# EAGLE design sound_localizer_v1 (EAGLE 7.6.0)
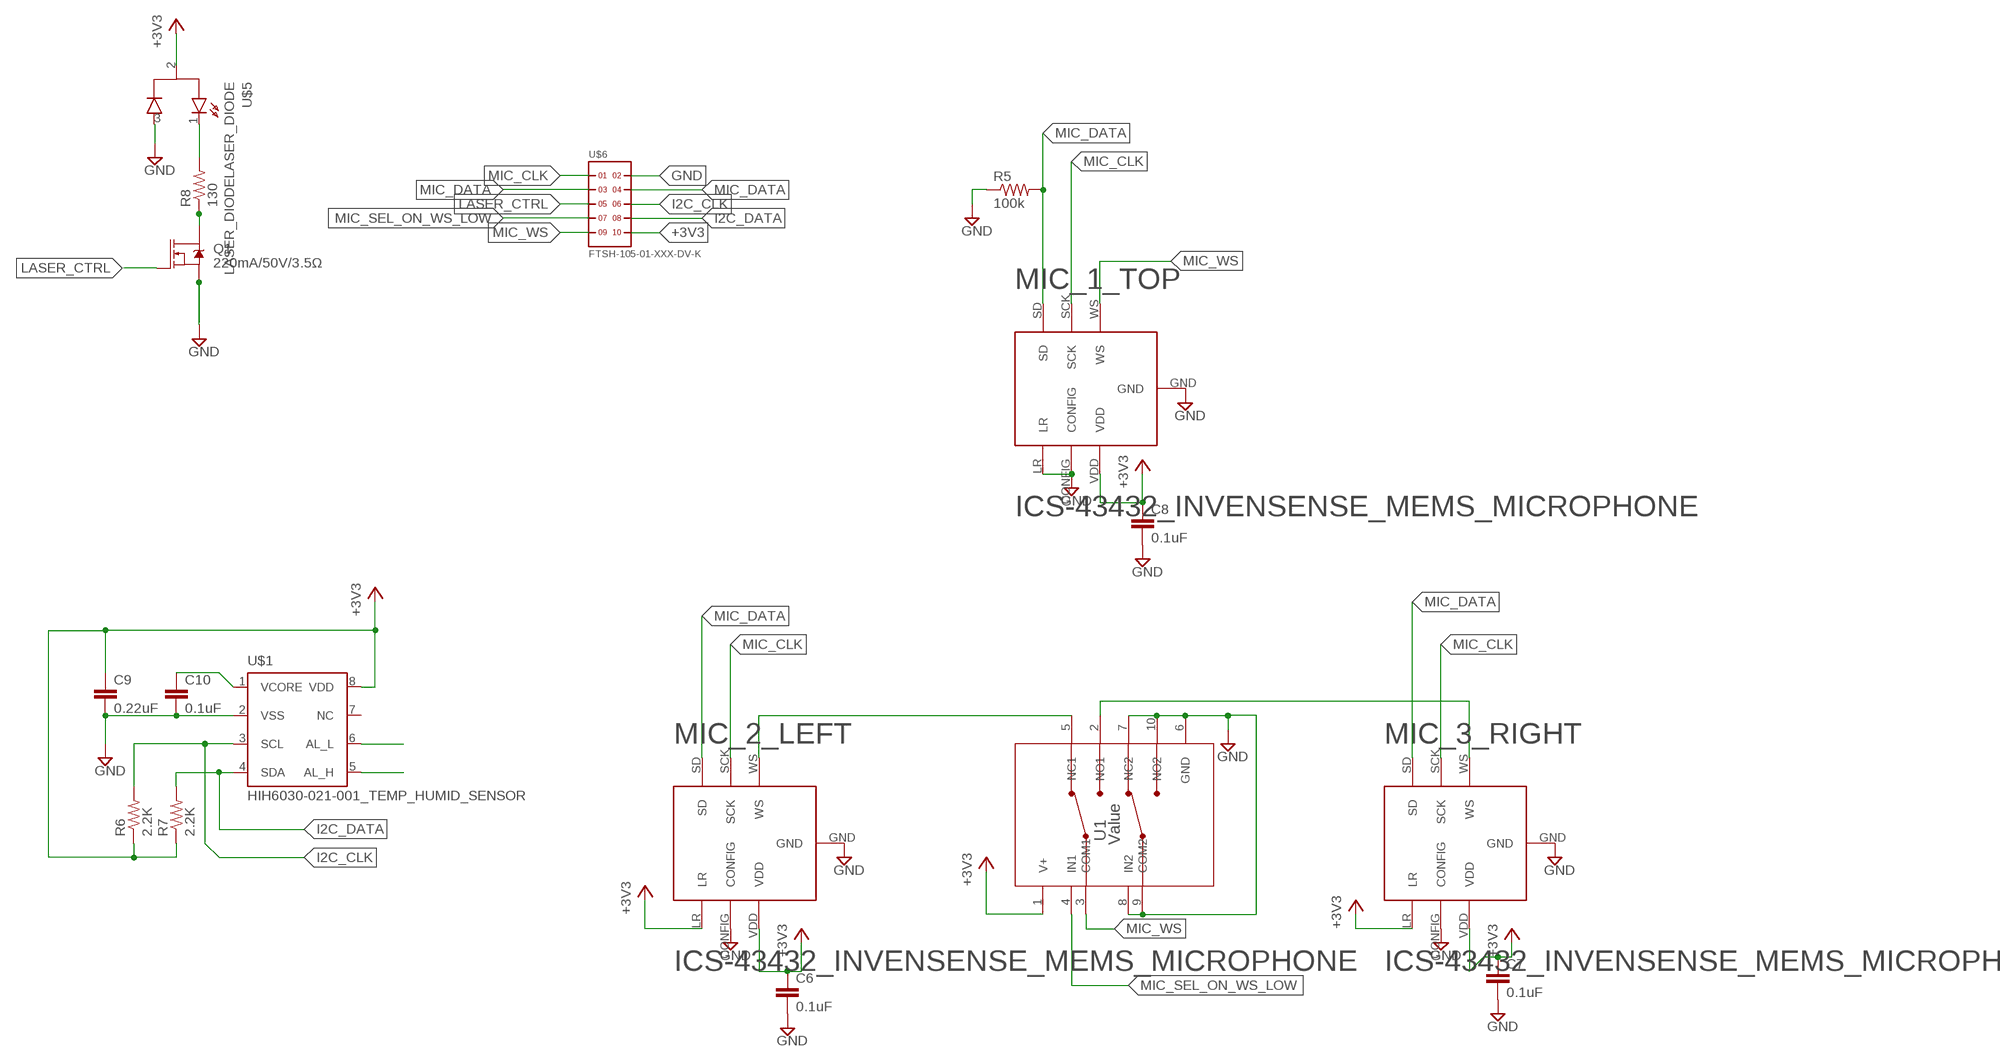
[diagram p0: schematic, sheet 1]

## Parts
C6  0.1uF  C-EUC0805K  [C0805K]
C7  0.1uF  C-EUC0805K  [C0805K]
C8  0.1uF  C-EUC0805K  [C0805K]
C9  0.22uF  C-EUC0805K  [C0805K]
C10  0.1uF  C-EUC0805K  [C0805K]
MIC_1_TOP  ICS-43432_INVENSENSE_MEMS_MICROPHONE  [MEMS_MIC]
MIC_2_LEFT  ICS-43432_INVENSENSE_MEMS_MICROPHONE  [MEMS_MIC]
MIC_3_RIGHT  ICS-43432_INVENSENSE_MEMS_MICROPHONE  [MEMS_MIC]
Q1  220mA/50V/3.5Ω  MOSFET-NCH-BSS138  [SOT23-3]
R5  100k  R-US_M0805  [M0805]
R6  2.2K  R-US_M0805  [M0805]
R7  2.2K  R-US_M0805  [M0805]
R8  130  R-US_M0805  [M0805]
U1  Value  TS3A24159DGSR  [DGS0010A_N]
U$1  HIH6030-021-001_TEMP_HUMID_SENSOR  [SOIC8]
U$5  LASER_DIODELASER_DIODE  [TO46-LX]
U$6  FTSH-105-01-XXX-DV-K  [FTSH-105-01-XXX-DV-K]

## Nets
+3V3 [pwr]: C6.1 C7.1 C8.1 C9.1 MIC_1_TOP.VDD MIC_2_LEFT.LR MIC_2_LEFT.VDD MIC_3_RIGHT.LR MIC_3_RIGHT.VDD R6.1 R7.1 U1.1(V+) U$1.8(VDD) U$5.2 U$6.10
GND [pwr]: C6.2 C7.2 C8.2 C9.2 C10.2 MIC_1_TOP.CONFIG MIC_1_TOP.GND MIC_1_TOP.LR MIC_2_LEFT.CONFIG MIC_2_LEFT.GND MIC_3_RIGHT.CONFIG MIC_3_RIGHT.GND Q1.2(S) R5.1 U1.6(GND) U1.7(NC2) U1.8(IN2) U1.9(COM2) U1.10(NO2) U$1.2(VSS) U$6.2
I2C_CLK: R6.2 U$1.3(SCL) U$6.6
I2C_DATA: R7.2 U$1.4(SDA) U$6.8
LASER_CTRL: Q1.1(G) U$6.5
LED_CATHODE: R8.2 U$5.1
MIC_CLK: MIC_1_TOP.SCK MIC_2_LEFT.SCK MIC_3_RIGHT.SCK U$6.1
MIC_DATA: MIC_1_TOP.SD MIC_2_LEFT.SD MIC_3_RIGHT.SD R5.2 U$6.3 U$6.4
MIC_SEL_ON_WS_LOW: U1.4(IN1) U$6.7
MIC_WS: MIC_1_TOP.WS U1.3(COM1) U$6.9
N$1: MIC_2_LEFT.WS U1.5(NC1)
N$2: MIC_3_RIGHT.WS U1.2(NO1)
N$4: C10.1 U$1.1(VCORE)
N$5: U$1.5(AL_H)
N$6: Q1.3(D) R8.1
NC: U$1.6(AL_L)
Unconnected: U$1.7(NC)

## Power pins joined to a net without a drawn wire
P$1: U$5.3

## Library data of the parts
C6-C10 = resistor:C-EU: CAPACITOR, European symbol
MIC_1_TOP MIC_2_LEFT MIC_3_RIGHT = custom:ICS-43432_INVENSENSE_MEMS_MICROPHONE
Q1 = SparkFun-DiscreteSemi:MOSFET-NCH: N-channel MOSFETs Voltage controlled devices that allow control of high current outputs. SparkFun Products: SparkFun OpenScale <https://www.sparkfun.com/products/13261> SparkFun Digital Sandbox <https://www.sparkfun.com/products/12651> SparkFun Monster Moto Shield <https://www.sparkfun.com/products/10182> SparkFun MOSFET Power Controller <https://www.sparkfun.com/products/11214>; PROD_ID: TRANS-00830
R5-R8 = resistor:R-US_: RESISTOR, American symbol
U1 = custom:TS3A24159DGSR; APPLICATION_BUILDNUMBER: *; COMPTYPE: IC; MANUFACTURER: Texas Instruments; MOUNTTYPE: SMT; PACKAGEREFERENCE: DGS0010A; PARTNUMBER: TS3A24159DGSR; PIN_COUNT: 10; REFDES: RefDes; ROHS: Y; TYPE: TYPE
U$1 = custom:HIH6030-021-001_TEMP_HUMID_SENSOR
U$5 = custom:LASER_DIODE
U$6 = samtec:FTSH-105-01-XXX-DV-K

## Net classes
0 signal: width 0.508 mm, drill 0.889 mm, clearance 0.254 mm
1 pwr: width 1.016 mm, drill 0.889 mm, clearance 1.016 mm

## Board
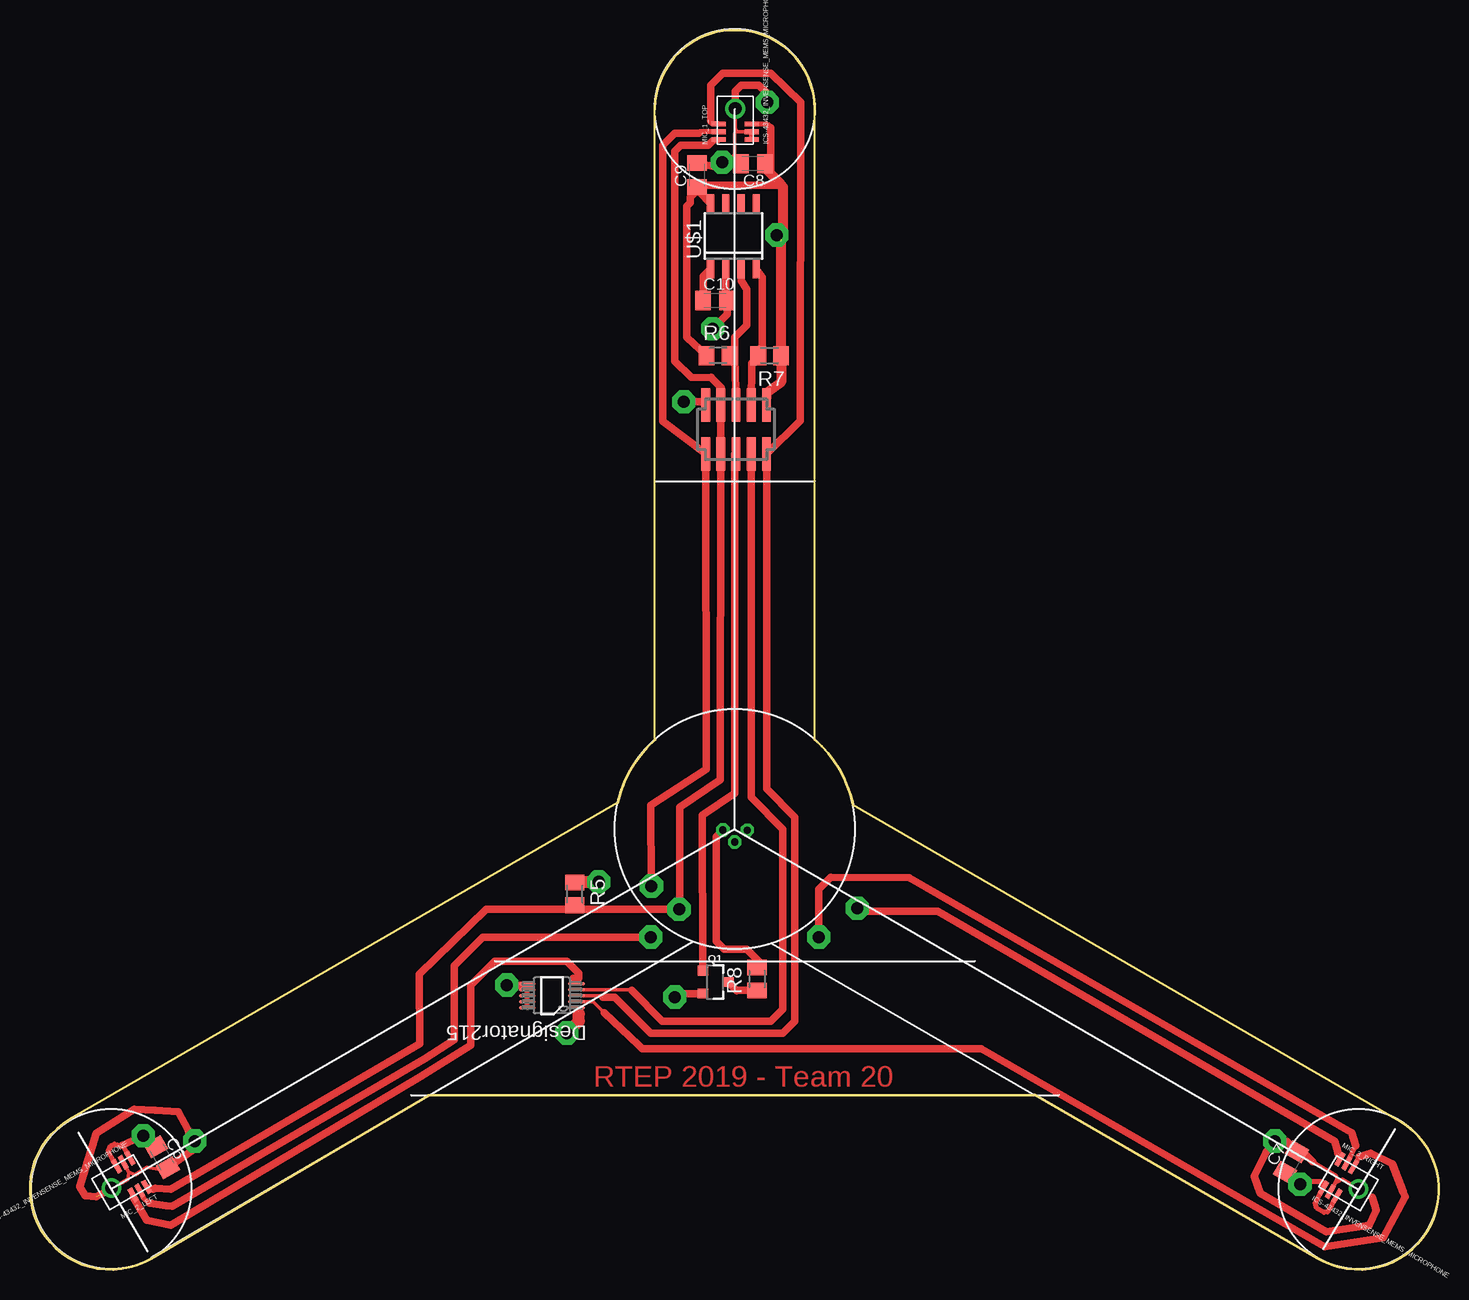
[diagram p1: board, top side]
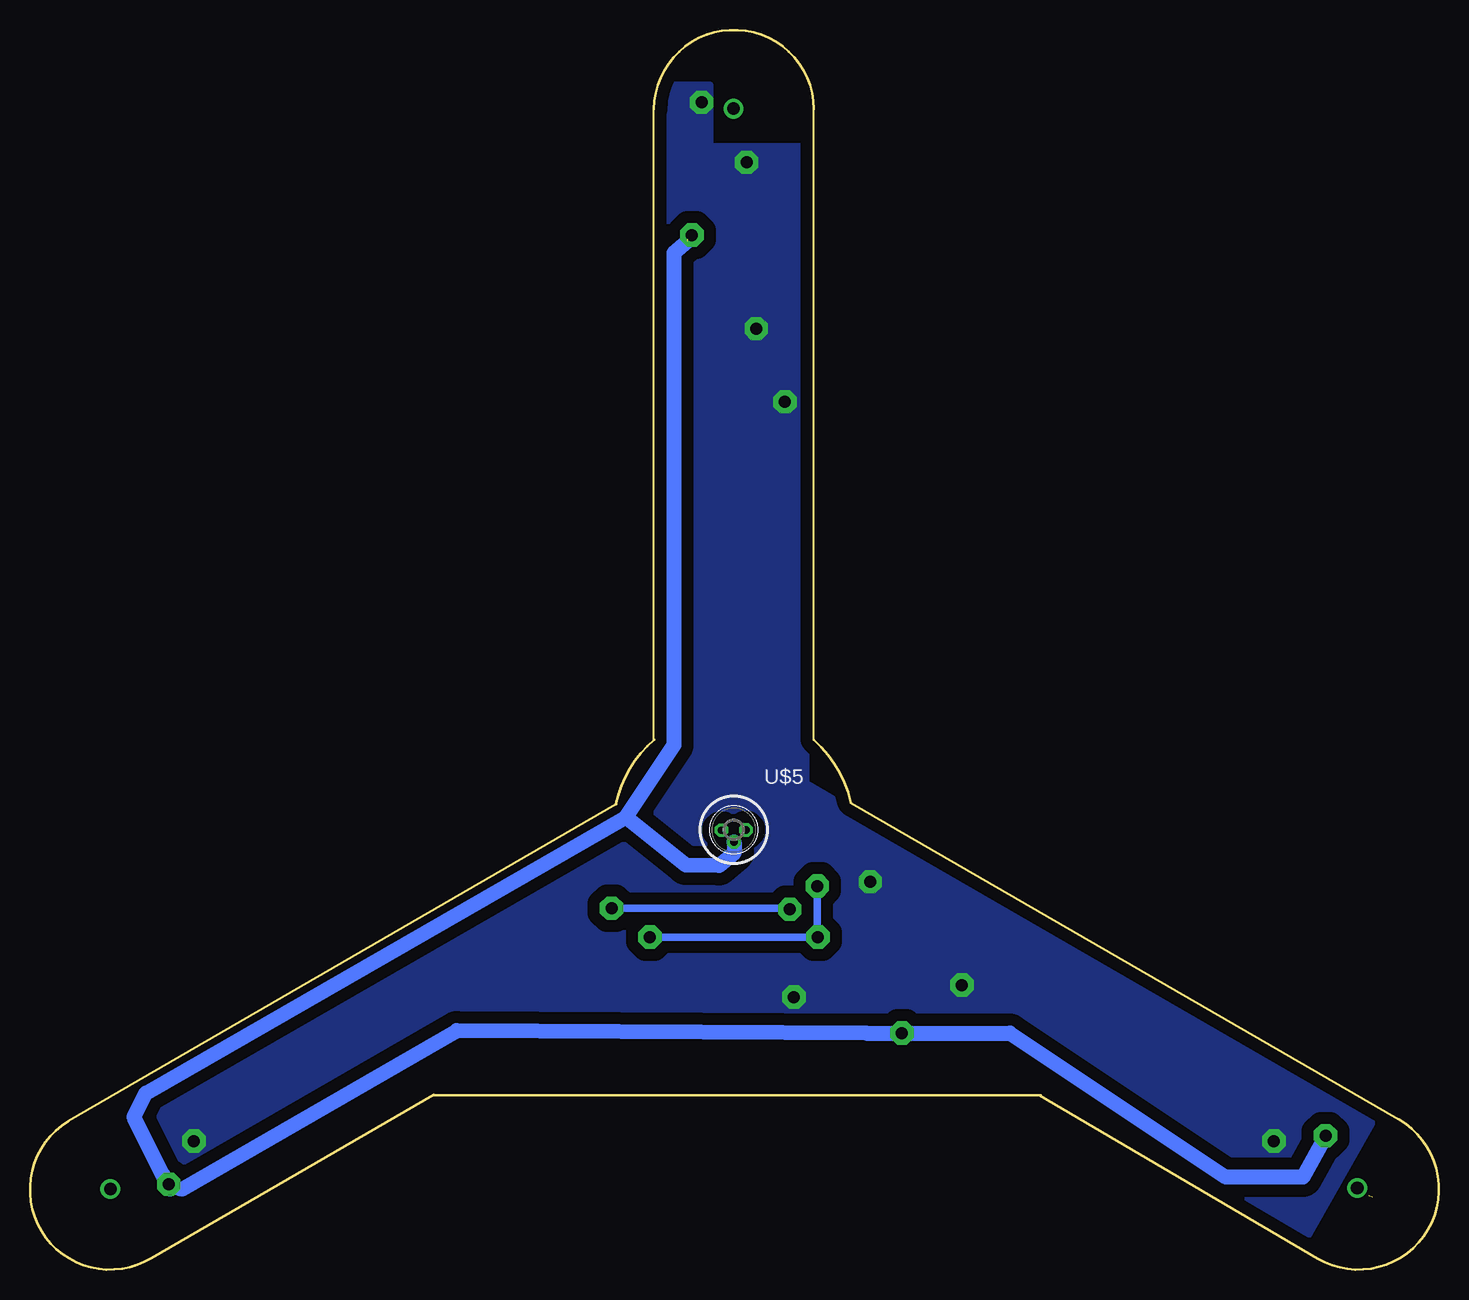
[diagram p2: board, bottom side, seen from below]

Size 117.4 x 103.29 mm. Coordinates in mm from the lower left corner, seen from the top.
Outline: 65.4,44.16 65.4,96.71 arc179 52.07,96.71 52.07,44.16
Outline: 68.54,38.76 114.2,12.36
Outline: 3.33,12.51 48.99,38.91 arc-35 52.09,44.16
Outline: 33.19,14.51 33.29,14.51
Outline: 33.29,14.51 83.79,14.51
Outline: 83.74,14.56 107.29,0.96 arc180 114.2,12.36
Outline: 33.29,14.51 10.09,0.91 arc-180 3.33,12.51
Outline: 65.39,44.16 arc-37 68.59,38.76
Copper layers (1*16): Top 0.035mm / dielectric 1.5mm / Bottom 0.035mm
Design rules "default": minimum track width 6mil, minimum drill 0.35mm, track to track 6mil, track to pad 6mil, pad to pad 6mil, via to via 6mil, smd to smd 6mil, copper to edge 40mil, drill to drill 6mil, minimum pad ring 10mil, minimum via ring 8mil, stop-mask expansion 4mil, vias tented up to drill 0mil, thermal gap 10mil

### Footprints (pad centres in the part's own frame; a part is rotated, then mirrored left to right if it is on the bottom)
C0805K = smd 1.3 x 1.6: 1 -1,0; 2 1,0
MEMS_MIC = smd 0.4 x 1.2: CONFIG -1.935,-1.399; LR -2.584,-1.399; SCK -1.935,1.351; SD -2.584,1.351; VDD -1.284,-1.399; WS -1.284,1.351 | drill 1.05 pad 1.65: GND -0.009,-0.024
SOT23-3 = smd 0.8 x 0.9: 1 -0.95,-1; 2 0.95,-1; 3 0,1.1
M0805 = smd 1.3 x 1.6: 1 -0.95,0; 2 0.95,0
DGS0010A_N = smd 1.4 x 0.3: 1 -2.05,1; 2 -2.05,0.5; 3 -2.05,0; 4 -2.05,-0.5; 5 -2.05,-1; 6 2.05,-1; 7 2.05,-0.5; 8 2.05,0; 9 2.05,0.5; 10 2.05,1
SOIC8 = smd 0.6 x 1.5: 1 -1.905,-2.75; 2 -0.635,-2.75; 3 0.635,-2.75; 4 1.905,-2.75; 5 1.905,2.75; 6 0.635,2.75; 7 -0.635,2.75; 8 -1.905,2.75
TO46-LX = drill 0.6 octagon: 1 1.02,-0.02; 2 0.03,-1.02; 3 -1.02,-0.03
FTSH-105-01-XXX-DV-K = smd 0.737 x 2.794: 1 -2.54,-2.032; 2 -2.54,2.032; 3 -1.27,-2.032; 4 -1.27,2.032; 5 0,-2.032; 6 0,2.032; 7 1.27,-2.032; 8 1.27,2.032; 9 2.54,-2.032; 10 2.54,2.032

### Placement (x,y rotation side)
C6  10.99,9.36 300 top
C7  105.09,8.96 60 top
C8  60.24,92.16 180 top
C9  55.59,91.21 90 top
C10  57.09,80.76 0 top
MIC_1_TOP  58.75,96.75 90 top
MIC_2_LEFT  6.8,6.76 210 top
MIC_3_RIGHT  110.73,6.73 330 top
Q1  57.08,23.95 270 top
R5  45.39,31.31 270 top
R6  57.34,76.16 0 top
R7  61.64,76.16 180 top
R8  60.59,24.21 90 top
U1  43.49,22.82 180 top
U$1  58.61,86.12 0 top
U$5  58.76,36.64 0 bottom
U$6  58.84,70.01 0 top

### Tracks (layer width: path | path; a pad name or v marks a point on that pad's centre or on a via)
+3V3  (via drill 1 pad 1.93)  (1 unrouted)
  Top 0.305: U1.1 45.74,21.62 45.74,21.31
  Top 0.406: MIC_1_TOP.VDD 61.43,95.46 61.74,95.16 | MIC_3_RIGHT.VDD 108.44,5.31 108.14,4.81 107.84,4.76 107.24,5.11 107.09,5.56 MIC_3_RIGHT.LR 107.69,7.31 105.84,7.31 v105.84,7.11 | MIC_2_LEFT.VDD 6.54,9.81 6.74,10.31 7.04,10.46 7.64,10.36 7.69,10.36 MIC_2_LEFT.LR
  Top 0.61: 61.74,95.16 61.74,91.71 C8.1 61.19,91.86 | U$1.8 55.8,89.77 | 55.8,89.77 55.4,90.17 55.4,90.04 55.56,89.88 | 55.56,89.88 55.04,89.36 55.04,88.91 54.74,88.61 54.74,77.71 R6.1 | 55.56,89.88 56.04,90.36 62.29,90.36 62.49,90.56 | 7.69,10.36 v9.44,11.16 C6.1 | C7.1 104.85,8.09 v105.84,7.11 | C9.1 55.8,89.77 | U$6.10 61.54,73.16
  Top 0.813: 61.19,91.86 62.49,90.56 62.74,90.22 62.74,86.71 v62.24,86.21 62.59,85.86 R7.1 62.59,73.96 61.54,73.16
  Top 1.016: v44.74,19.71 45.74,20.71 45.74,21.31
  Bottom 1.27: U$5.2 58.73,34.72 59.99,33.66 62.74,33.71 67.74,37.71 | v9.44,11.16 11.34,7.71 17.74,7.71 35.74,19.71 v44.74,19.71 47.74,19.71 81.86,19.91 104.74,6.71 v105.84,7.11 106.34,7.91 | 106.34,7.91 108.74,12.71 107.74,14.71 67.74,37.71 | 106.34,7.91 105.74,6.71 | 67.74,37.71 63.74,43.71 63.74,84.71 62.59,85.71
GND  (via drill 1 pad 1.93)  (1 unrouted)
  Top 0.305: MIC_1_TOP.GND 58.77,95.07 58.99,94.81 60.1,94.81 MIC_1_TOP.CONFIG 58.84,94.81 58.74,94.71 58.74,92.71 58.8,92.71 | MIC_3_RIGHT.GND 109.34,7.51 108.79,7.21 MIC_3_RIGHT.CONFIG 108.94,7.56 108.84,7.81 106.91,8.99 106.79,9.06 | MIC_2_LEFT.CONFIG 8.24,8.11 | 8.24,8.11 8.19,7.76 8.14,7.51 5.84,6.21 | 11.14,8.26 9.79,8.51 8.79,7.91 8.24,8.11
  Top 0.406: 60.1,94.81 60.1,94.21 MIC_1_TOP.LR | U1.10 U1.9 U1.8 U1.7 U1.6 41.74,23.71
  Top 0.61: Q1.2 54.03,23 v53.74,22.71 | v61.44,97.26 61.44,98.01 60.74,98.71 59.29,98.71 58.79,98.21 58.79,96.75 MIC_1_TOP.GND | 54.05,72.75 v54.49,72.31 56.03,72.31 U$6.2 | U$1.2 57.99,83.35 57.99,80.86 C10.2 58.09,79.61 v56.89,78.41 | v57.69,92.26 57.3,91.87 C9.2 | v57.69,92.26 58.29,92.26 58.74,92.71 | 13.49,9.91 13.19,11.61 12.34,13.16 10.44,13.26 8.69,13.36 5.54,11.36 4.14,6.91 4.59,6.16 5.54,6.06 MIC_2_LEFT.GND | 13.49,9.91 v13.74,10.71 | v39.74,23.71 41.74,23.71 | 106.91,8.99 106.07,9.82 C7.2 105.59,9.86 104.74,10.71 103.94,10.71 | 103.94,10.71 103.04,9.81 102.04,7.76 102.54,6.36 108.04,3.16 111.59,3.71 112.19,4.96 111.84,6.01 | v103.74,10.71 103.94,10.71 | C6.2 13.49,9.91 | C8.2 v57.69,92.26
  Top 1.016: v47.39,32.31 47.34,32.26 R5.1
  pour Bottom: 5.09,12.81 52.64,40.56 52.69,93.66 64.84,93.71 64.84,40.21 111.74,13.06 105.79,2.56 84.09,15.06 33.29,15.06 11.04,2.31
  pour Bottom: 60.74,93.71 60.74,98.71 63.94,98.71 64.74,93.71
I2C_CLK
  Top 0.61: U$1.3 59.29,82.41 59.74,81.71 59.74,78.71 58.74,77.71 58.74,75.96 | U$6.6 58.74,75.96 | R6.2 58.49,75.96 58.74,75.96
I2C_DATA
  Top 0.61: U$1.4 61.04,82.71 61.04,77.01 R7.2 60.74,75.71 60.14,75.51 U$6.8
LASER_CTRL
  Top 0.61: U$6.5 58.74,67.98 58.74,39.71 56.04,37.86 Q1.1
LED_CATHODE
  Top 0.61: U$5.1 57.19,36.07 57.19,27.36 57.84,26.71 59.74,26.71 60.74,25.71 60.59,25.56 R8.2
MIC_CLK  (via drill 1 pad 1.93)
  Top 0.406: MIC_2_LEFT.SCK 9.54,5.86 9.74,5.71 9.99,5.51 | MIC_1_TOP.SCK 55.84,94.81 55.74,94.71 | MIC_3_RIGHT.SCK 110.49,10.31
  Top 0.61: 9.99,5.51 11.34,5.31 11.84,5.26 32.89,17.56 35.34,19.16 35.34,25.31 37.74,27.71 v51.74,27.71 | 55.74,94.71 53.74,94.71 52.74,93.71 52.74,70.71 U$6.1 56.34,41.71 51.74,38.71 v51.79,31.96 | 110.49,10.31 110.14,11.41 73.29,32.66 66.74,32.71 65.74,31.71 v65.74,27.71
  Bottom 0.61: v51.79,31.96 51.79,27.76 v51.74,27.71 v65.74,27.71
MIC_DATA  (via drill 1 pad 1.93)
  Top 0.406: 108.99,9.71 MIC_3_RIGHT.SD | 10.29,6.71 MIC_2_LEFT.SD | 56.89,94.06 57.29,94.06 MIC_1_TOP.SD
  Top 0.61: 108.99,9.71 108.99,9.81 108.74,10.71 75.64,29.86 69.19,29.86 v68.94,30.11 | 10.29,6.71 10.44,6.76 11.74,6.71 32.49,18.81 32.44,24.61 38.04,30.01 44.74,30.01 45.04,30.01 | 56.79,74.31 57.62,73.48 U$6.4 U$6.3 57.54,40.81 54.14,38.51 54.14,29.91 | 56.89,94.06 56.54,93.71 54.24,93.71 53.74,93.21 53.74,75.71 55.09,74.36 56.79,74.31 | 56.79,74.36 56.79,74.31 | 54.14,29.91 54.19,29.86 | 45.04,30.01 v54.09,30.01 54.14,29.91 | 45.74,30.71 R5.2 45.04,30.01
  Bottom 0.61: v68.94,30.11 54.19,30.11 v54.09,30.01
MIC_SEL_ON_WS_LOW
  Top 0.305: 49.89,23.31 49.74,23.31 | 49.74,23.31 U1.4 | 50.14,23.26 49.74,23.31
  Top 0.61: U$6.7 60.11,39.34 62.74,36.71 62.74,21.71 61.74,20.71 52.69,20.71 50.14,23.26
MIC_WS
  Top 0.305: U1.3 47.64,22.81 47.74,22.71
  Top 0.406: MIC_1_TOP.WS 56.84,95.46 56.74,95.71
  Top 0.61: 47.74,22.71 48.74,22.71 51.74,19.71 62.74,19.71 63.74,20.71 63.74,37.71 61.38,40.07 U$6.9 64.19,70.74 64.24,97.26 61.74,99.71 57.74,99.71 56.74,98.71 56.74,95.71
N$1
  Top 0.305: 45.29,24.26 U1.5
  Top 0.406: MIC_2_LEFT.WS 8.59,6.01
  Top 0.61: 8.59,6.01 9.14,5.11 9.74,4.11 11.74,3.71 32.54,16.06 36.74,18.71 36.74,23.71 38.74,25.71 44.74,25.71 45.74,24.71 45.74,24.26 45.29,24.26
N$2
  Top 0.305: U1.2 46.94,22.31 47.84,21.41
  Top 0.406: MIC_3_RIGHT.WS 110.79,9.41
  Top 0.61: 47.84,21.41 50.74,18.71 51.04,18.41 63.74,18.41 64.54,18.41 79.29,18.41 107.89,1.91 112.79,2.66 114.59,6.06 114.44,6.46 113.54,8.81 111.74,9.71 110.79,9.41
N$4
  Top 0.61: U$1.1 56.09,82.75 C10.1
N$6
  Top 0.61: Q1.3 58.9,23.22 58.94,23.26 R8.1

### Text on the board
Top: RTEP 2019 - Team 20